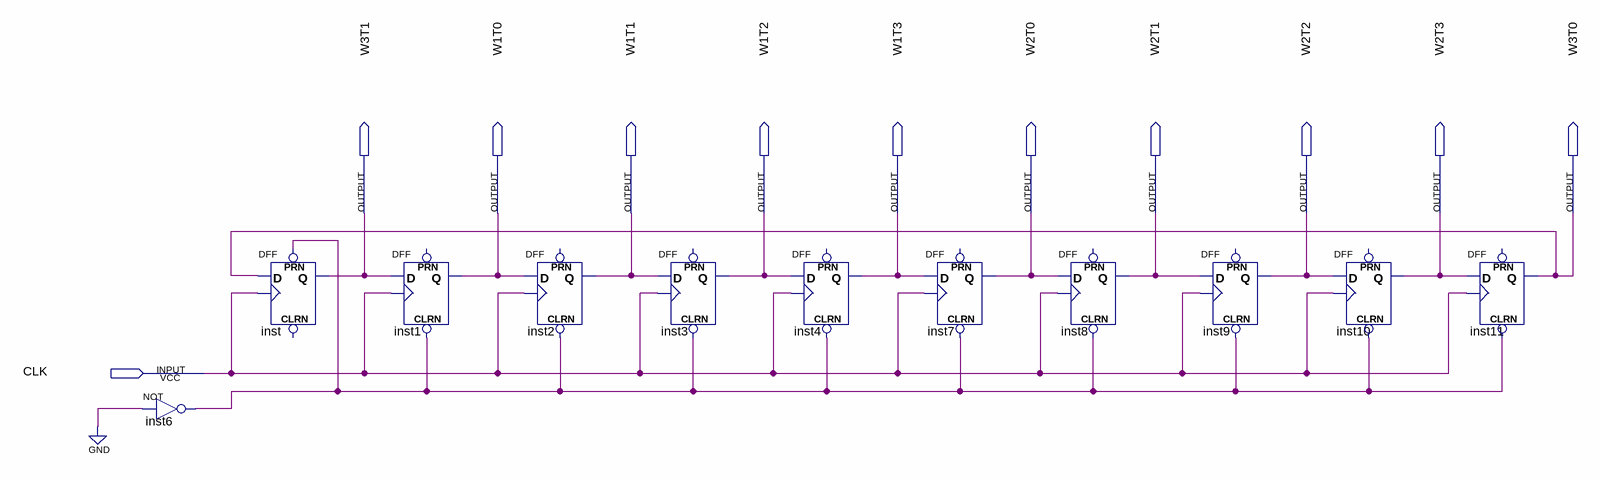
[diagram p0: schematic sheet]
// Quartus schematic Beats.bdf as structural Verilog: 11 symbols, 11 pins
module Beats (
  input  CLK,
  output W3T1,
  output W1T0,
  output W1T1,
  output W1T2,
  output W1T3,
  output W2T0,
  output W2T1,
  output W2T2,
  output W2T3,
  output W3T0
);

  wire inst6_out;

  not inst6 (inst6_out, 1'b0);
  DFF inst (.CLK(CLK), .D(W3T0), .PRN(inst6_out), .Q(W3T1));  // open: CLRN
  DFF inst1 (.CLRN(inst6_out), .CLK(CLK), .D(W3T1), .Q(W1T0));  // open: PRN
  DFF inst2 (.CLRN(inst6_out), .CLK(CLK), .D(W1T0), .Q(W1T1));  // open: PRN
  DFF inst3 (.CLRN(inst6_out), .CLK(CLK), .D(W1T1), .Q(W1T2));  // open: PRN
  DFF inst4 (.CLRN(inst6_out), .CLK(CLK), .D(W1T2), .Q(W1T3));  // open: PRN
  DFF inst7 (.CLRN(inst6_out), .CLK(CLK), .D(W1T3), .Q(W2T0));  // open: PRN
  DFF inst8 (.CLRN(inst6_out), .CLK(CLK), .D(W2T0), .Q(W2T1));  // open: PRN
  DFF inst9 (.CLRN(inst6_out), .CLK(CLK), .D(W2T1), .Q(W2T2));  // open: PRN
  DFF inst10 (.CLRN(inst6_out), .CLK(CLK), .D(W2T2), .Q(W2T3));  // open: PRN
  DFF inst11 (.CLRN(inst6_out), .CLK(CLK), .D(W2T3), .Q(W3T0));  // open: PRN
endmodule
